# Altium schematic sheet AS7331.SchDoc: LPEDT_Project_Schematic
size A; Revision: 1; SheetNumber: 2; SheetTotal: 7
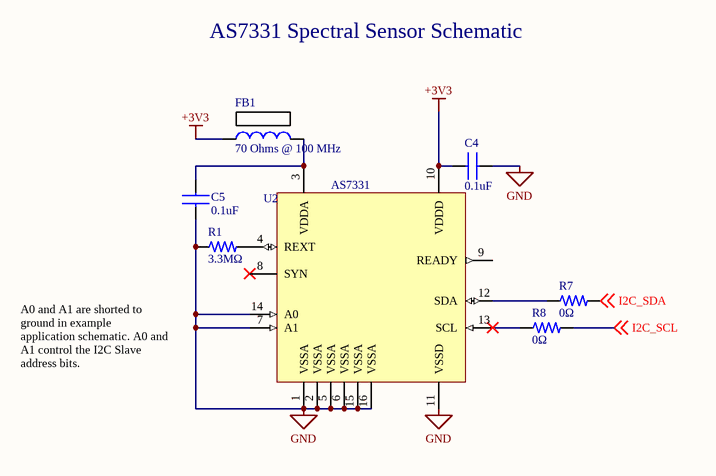
[diagram p0: AS7331.SchDoc]

## Parts
C4  0.1uF  [C_0603]
C5  0.1uF  [C_0603]
FB1  70 Ohms @ 100 MHz  [FB_0603]
R1  3.3MΩ  [R_0603]
R7  0Ω  [R_0603]
R8  0Ω  [R_0603]
U2  AS7331  [U_AS7331]

## Nets
+3V3: C4.2 FB1.1 U2.10(VDDD)
GND: C4.1 C5.2 R1.1 U2.1(VSSA) U2.2(VSSA) U2.5(VSSA) U2.6(VSSA) U2.7(A1) U2.11(VSSD) U2.14(A0) U2.15(VSSA) U2.16(VSSA)
I2C_SCL: R8.2 ; off-sheet I2C_SCL
I2C_SDA: R7.2 ; off-sheet I2C_SDA
NetC5_1: C5.1 FB1.2 U2.3(VDDA)
NetR1_2: R1.2 U2.4(REXT)
NetR7_1: R7.1 U2.12(SDA)
NetR8_1: R8.1 U2.13(SCL)

Not connected (* = marked no-connect by the designer): U2 8(SYN)* 9(READY)

## Notes on the sheet
- AS7331 Spectral Sensor Schematic
- A0 and A1 are shorted to ground in example application schematic. A0 and A1 control the I2C Slave address bits.

## Library data of the parts
C4 C5 = C_0.1U_0603: CAP CER 0.1UF 10V X5R 0603; Manufacturer: KEMET; Manufacturer Part Number: C0603C104K8PAC7867; Dielectric Material: Ceramic; Supplier: Digikey; Supplier Part Number: 399-17573-1-ND; RoHS: Yes; Category: Ceramic Capacitors; Stock: 13122; Pricing: 1=0.18, 10=0.119, 50=0.075, 100=0.06, 500=0.04332, 1000=0.03833 (USD); Pins: 2; Capacitor Type: Ceramic; Reach SVHC Compliant: Yes; RoHS Compliant: Yes; ComponentLink1URL: https://datasheet.ciiva.com:443/pdfs/VipMasterIC/IC/KEME/KEME-S-A0007617622/KEME-S-A0007611556-1.pdf?src-supplier=IHS+Markit; ComponentLink1Description: https://datasheet.ciiva.com:443/pdfs/VipMasterIC/IC/KEME/KEME-S-A0007617622/KEME-S-A0007611556-1.pdf?src-supplier=IHS+Markit; ComponentLink2URL: https://api.kemet.com/component-edge/download/datasheet/C0603C104K8PAC7867.pdf?src-supplier=Digikey; ComponentLink2Description: https://api.kemet.com/component-edge/download/datasheet/C0603C104K8PAC7867.pdf?src-supplier=Digikey
FB1 = BLM18SG700TN1D: Ferrite Chip, 1 Function(s), 4A, 2 Pin(s); Manufacturer: Murata; DC Resistance-Max: 20mR; Clock Frequency: 100MHz; Channels: 1; Output Impedance: 70R; Supplier: Digikey; Supplier Part Number: 490-5224-1-ND; Manufacturer Part Number: BLM18SG700TN1D; RoHS: Yes; Category: Ferrite Beads and Chips; Stock: 330015; Pricing: 1=0.13, 10=0.109, 25=0.0848, 50=0.0702, 100=0.0605, 250=0.0484, 500=0.04356, 1000=0.03631, 5000=0.03389 (USD); Mounting Technology: Surface Mount; Material: Ferrite; Case Code: 0603; Terminal Finish: Tin; Min Operating Temperature: -55°C; Max Operating Temperature: 125°C; JESD-609 Code: e3; Construction: Chip Bead; Filter Type: FERRITE CHIP; Min Frequency: 100MHz; Packaging: Tape and Reel; Current Rating: 4A; Length: 1.6mm; Width: 0.8mm; Height: 0.5mm; Reach SVHC Compliant: Yes; RoHS Compliant: Yes; ComponentLink1URL: https://datasheet.ciiva.com:443/pdfs/VipMasterIC/IC/MURE/MURE-S-A0008515766/MURE-S-A0008515869-1.pdf?src-supplier=IHS+Markit; ComponentLink1Description: https://datasheet.ciiva.com:443/pdfs/VipMasterIC/IC/MURE/MURE-S-A0008515766/MURE-S-A0008515869-1.pdf?src-supplier=IHS+Markit; ComponentLink2URL: https://datasheet.ciiva.com/41449/001171727-da-01-en-chip-drossel0603-70r-4000ma-1-6x0-8mm-41449356.pdf?src-supplier=Conrad; ComponentLink2Description: https://datasheet.ciiva.com/41449/001171727-da-01-en-chip-drossel0603-70r-4000ma-1-6x0-8mm-41449356.pdf?src-supplier=Conrad; ComponentLink3URL: https://datasheet.ciiva.com/41449/001172316-da-01-en-drossel-0603-70r-1-6x0-8mm-10000st-41449678.pdf?src-supplier=Conrad; ComponentLink3Description: https://datasheet.ciiva.com/41449/001172316-da-01-en-drossel-0603-70r-1-6x0-8mm-10000st-41449678.pdf?src-supplier=Conrad; ComponentLink4URL: https://datasheet.ciiva.com/8021/5151-8021530.pdf?src-supplier=Element14; ComponentLink4Description: https://datasheet.ciiva.com/8021/5151-8021530.pdf?src-supplier=Element14; ComponentLink5URL: https://datasheet.ciiva.com/14122/blm-series-eng-tds-14122901.pdf?src-supplier=Distrelec; ComponentLink5Description: https://datasheet.ciiva.com/14122/blm-series-eng-tds-14122901.pdf?src-supplier=Distrelec; ComponentLink6URL: https://datasheet.ciiva.com/8021/5151-8021529.pdf?src-supplier=Element14; ComponentLink6Description: https://datasheet.ciiva.com/8021/5151-8021529.pdf?src-supplier=Element14; ComponentLink7URL: https://datasheet.ciiva.com/6212/l0110s0100blm18s-6212357.pdf?src-supplier=Digikey; ComponentLink7Description: https://datasheet.ciiva.com/6212/l0110s0100blm18s-6212357.pdf?src-supplier=Digikey
R1 = R_3.3M_0603: RES 3.3MOHM 0.1W 0603; Manufacturer: Yageo; Manufacturer Part Number: RC0603FR-073M3L; Tolerance: 1%; Additional Feature: LASER TRIMMABLE; Power: 100mW; Rated Temperature: 70°C; Value: 3.3MR; Temperature Coefficient: 100ppm/°C; Working Voltage: 75V; Package Height: 0.45mm; Package Length: 1.6mm; Package Width: 0.8mm; Supplier: Digikey; Supplier Part Number: 13-RC0603FR-073M3LCT-ND; RoHS: Yes; Category: Chip SMD Resistors; Stock: 44730; Pricing: 1=0.1, 10=0.019, 50=0.0112, 100=0.0093, 500=0.00622, 1000=0.00532 (USD); Mounting Technology: Surface Mount; Pins: 2; Package Shape: Rectangular; Case/Package: 0603; Terminal Finish: Nickel; Min Operating Temperature: -55°C; Max Operating Temperature: 155°C; JESD-609 Code: e3; Resistor Type: FIXED RESISTOR; Construction: Chip; Package Style: SMTMeter; Packaging: Tape and Reel; Technology: METAL GLAZE/THICK FILM; Termination: Wraparound; Reach SVHC Compliant: Yes; RoHS Compliant: Yes; ComponentLink1URL: https://datasheet.ciiva.com:443/pdfs/VipMasterIC/IC/YAGO/YAGO-S-A0008145938/YAGO-S-A0008145938-1.pdf?src-supplier=IHS+Markit; ComponentLink1Description: https://datasheet.ciiva.com:443/pdfs/VipMasterIC/IC/YAGO/YAGO-S-A0008145938/YAGO-S-A0008145938-1.pdf?src-supplier=IHS+Markit; ComponentLink2URL: https://datasheet.ciiva.com/7746/443971-7746349.pdf?src-supplier=Element14; ComponentLink2Description: https://datasheet.ciiva.com/7746/443971-7746349.pdf?src-supplier=Element14; ComponentLink3URL: https://datasheet.ciiva.com/7746/443971-7746350.pdf?src-supplier=Element14; ComponentLink3Description: https://datasheet.ciiva.com/7746/443971-7746350.pdf?src-supplier=Element14
R7 R8 = R_0_0603: RES 0OHM 0.1W 0603; Manufacturer: Stackpole Electronics; Manufacturer Part Number: RMCF0603ZT0R00; Power: 100mW; Rated Temperature: 70°C; Value: 0R; Working Voltage: 75V; Package Height: 0.45mm; Package Length: 1.55mm; Package Width: 0.8mm; Reference Standard: AEC-Q200; Supplier: Digikey; Supplier Part Number: RMCF0603ZT0R00CT-ND; RoHS: Yes; Category: Chip SMD Resistors; Stock: 13173551; Pricing: 1=0.1, 10=0.013, 25=0.0096, 50=0.0072, 100=0.0051, 250=0.00408, 500=0.00328, 1000=0.00241 (USD); Mounting Technology: Surface Mount; Pins: 2; Package Shape: Rectangular; Case/Package: 0603; Terminal Finish: Nickel; Min Operating Temperature: -55°C; Max Operating Temperature: 155°C; JESD-609 Code: e3; Resistor Type: FIXED RESISTOR; Construction: Rectangular; Package Style: SMTMeter; Packaging: Tape and Reel; Technology: METAL GLAZE/THICK FILM; Termination: Wraparound; Reach SVHC Compliant: Yes; RoHS Compliant: Yes; ComponentLink1URL: https://datasheet.ciiva.com:443/pdfs/VipMasterIC/IC/SEIE/SEIE-S-A0007077258/SEIE-S-A0007077258-1.pdf?src-supplier=IHS+Markit; ComponentLink1Description: https://datasheet.ciiva.com:443/pdfs/VipMasterIC/IC/SEIE/SEIE-S-A0007077258/SEIE-S-A0007077258-1.pdf?src-supplier=IHS+Markit; ComponentLink2URL: https://datasheet.octopart.com/RMCF0603ZT0R00-Stackpole-Electronics-datasheet-11547379.pdf?src-supplier=Future+Electronics; ComponentLink2Description: https://datasheet.octopart.com/RMCF0603ZT0R00-Stackpole-Electronics-datasheet-11547379.pdf?src-supplier=Future+Electronics; ComponentLink3URL: https://www.seielect.com/catalog/SEI-Packaging.pdf?src-supplier=Avnet; ComponentLink3Description: https://www.seielect.com/catalog/SEI-Packaging.pdf?src-supplier=Avnet; ComponentLink4URL: https://www.seielect.com/catalog/SEI-Packaging.pdf?src-supplier=Arrow+Electronics; ComponentLink4Description: https://www.seielect.com/catalog/SEI-Packaging.pdf?src-supplier=Arrow+Electronics; ComponentLink5URL: https://www.seielect.com/catalog/SEI-Packaging.pdf?src-supplier=Verical; ComponentLink5Description: https://www.seielect.com/catalog/SEI-Packaging.pdf?src-supplier=Verical; ComponentLink6URL: https://datasheet.octopart.com/RMCF0603ZT0R00-Stackpole-Electronics-datasheet-154799224.pdf?src-supplier=Master+Electronics; ComponentLink6Description: https://datasheet.octopart.com/RMCF0603ZT0R00-Stackpole-Electronics-datasheet-154799224.pdf?src-supplier=Master+Electronics
U2 = U_AS7331: Optical Sensor Ultraviolet (UV) 260nm ~ 360nm I2C 16-TFLGA Module; Manufacturer: Osram Opto; Manufacturer Part Number: AS7331-AQFMOLGA16LFT&R; Supplier: Digikey; Supplier Part Number: 4991-AS7331_MOLGA16LFT&RDPCT-ND; RoHS: No; Stock: 1805; Pricing: 1=10.86, 10=8.688, 25=8.0364, 100=6.9504, 500=6.51602 (USD)